# Altium schematic sheet Input2.SchDoc
size A4
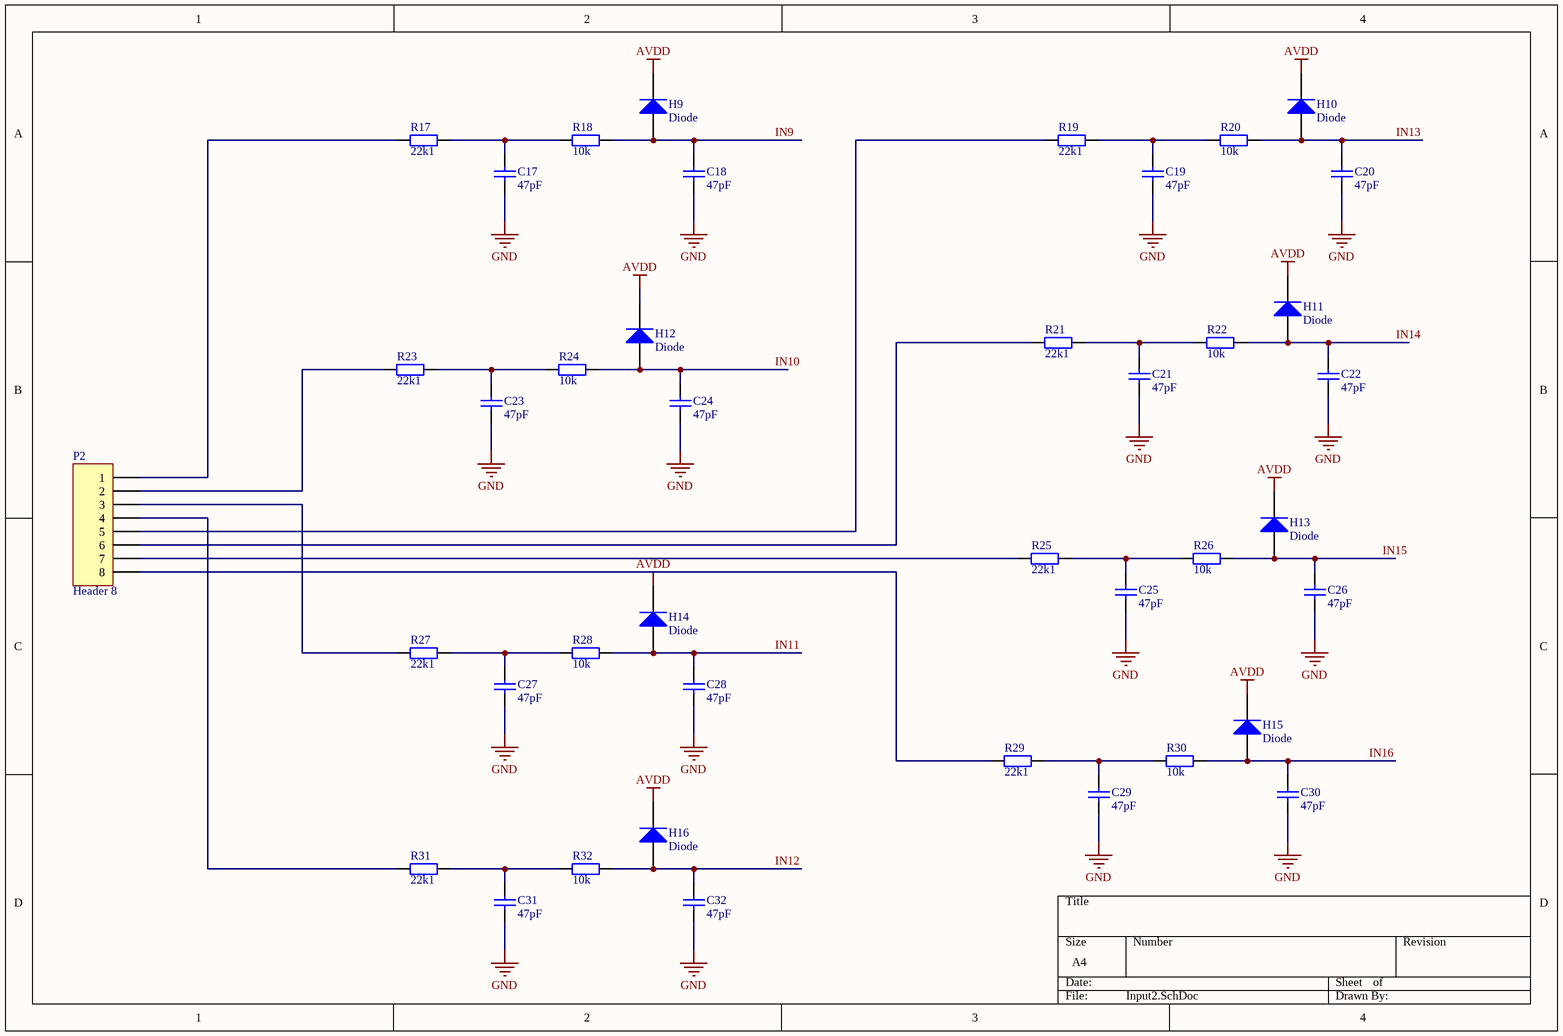
[diagram p0: Input2.SchDoc]

## Parts
C17  47pF  [RAD-0.3]
C18  47pF  [RAD-0.3]
C19  47pF  [RAD-0.3]
C20  47pF  [RAD-0.3]
C21  47pF  [RAD-0.3]
C22  47pF  [RAD-0.3]
C23  47pF  [RAD-0.3]
C24  47pF  [RAD-0.3]
C25  47pF  [RAD-0.3]
C26  47pF  [RAD-0.3]
C27  47pF  [RAD-0.3]
C28  47pF  [RAD-0.3]
C29  47pF  [RAD-0.3]
C30  47pF  [RAD-0.3]
C31  47pF  [RAD-0.3]
C32  47pF  [RAD-0.3]
H9  Diode  [SMC]
H10  Diode  [SMC]
H11  Diode  [SMC]
H12  Diode  [SMC]
H13  Diode  [SMC]
H14  Diode  [SMC]
H15  Diode  [SMC]
H16  Diode  [SMC]
P2  Header 8  [HDR1X8]
R17  22k1  [AXIAL-0.4]
R18  10k  [AXIAL-0.4]
R19  22k1  [AXIAL-0.4]
R20  10k  [AXIAL-0.4]
R21  22k1  [AXIAL-0.4]
R22  10k  [AXIAL-0.4]
R23  22k1  [AXIAL-0.4]
R24  10k  [AXIAL-0.4]
R25  22k1  [AXIAL-0.4]
R26  10k  [AXIAL-0.4]
R27  22k1  [AXIAL-0.4]
R28  10k  [AXIAL-0.4]
R29  22k1  [AXIAL-0.4]
R30  10k  [AXIAL-0.4]
R31  22k1  [AXIAL-0.4]
R32  10k  [AXIAL-0.4]

## Nets
AVDD: H9.2(K) H10.2(K) H11.2(K) H12.2(K) H13.2(K) H14.2(K) H15.2(K) H16.2(K)
GND: C17.1 C18.1 C19.1 C20.1 C21.1 C22.1 C23.1 C24.1 C25.1 C26.1 C27.1 C28.1 C29.1 C30.1 C31.1 C32.1
IN9: C18.2 H9.1(A) R18.2
IN10: C24.2 H12.1(A) R24.2
IN11: C28.2 H14.1(A) R28.2
IN12: C32.2 H16.1(A) R32.2
IN13: C20.2 H10.1(A) R20.2
IN14: C22.2 H11.1(A) R22.2
IN15: C26.2 H13.1(A) R26.2
IN16: C30.2 H15.1(A) R30.2
NetC17_2: C17.2 R17.2 R18.1
NetC19_2: C19.2 R19.2 R20.1
NetC21_2: C21.2 R21.2 R22.1
NetC23_2: C23.2 R23.2 R24.1
NetC25_2: C25.2 R25.2 R26.1
NetC27_2: C27.2 R27.2 R28.1
NetC29_2: C29.2 R29.2 R30.1
NetC31_2: C31.2 R31.2 R32.1
NetP2_1: P2.1 R17.1
NetP2_2: P2.2 R23.1
NetP2_3: P2.3 R27.1
NetP2_4: P2.4 R31.1
NetP2_5: P2.5 R19.1
NetP2_6: P2.6 R21.1
NetP2_7: P2.7 R25.1
NetP2_8: P2.8 R29.1

## Library data of the parts
C17-C32 = Cap: Capacitor; Value: 100pF; Published: 8-Jun-2000; LatestRevisionDate: 17-Jul-2002; LatestRevisionNote: Re-released for DXP Platform.; PackageReference: RAD-0.3; Publisher: Altium Limited; PackageDescription: Radial Cap, Thru-Hole; 2 Leads; 0.3 in Pin Spacing
H9-H16 = Diode: Default Diode; Published: 8-Jun-2000; LatestRevisionDate: 17-Jul-2002; LatestRevisionNote: Re-released for DXP Platform.; PackageVersion: Sep-1996; PackageReference: SMC; Publisher: Altium Limited; PackageDescription: DO-214-AB/SMC; 2 C-Bend Leads; Body 7.9 x 5.9 mm, inc. leads (LxW); Code_JEDEC: DO-214-AB
P2 = Header 8: Header, 8-Pin; LatestRevisionDate: 17-Jul-2002; LatestRevisionNote: Re-released for DXP Platform.; Publisher: Altium Limited
R17-R32 = Res2: Resistor; Value: 1K; Published: 8-Jun-2000; LatestRevisionDate: 17-Jul-2002; LatestRevisionNote: Re-released for DXP Platform.; PackageReference: AXIAL-0.4; Publisher: Altium Limited; PackageDescription: Axial Device, Thru-Hole; 2 Leads; 0.4 in Pin Spacing